# EAGLE design line tracer (EAGLE 9.5.0)
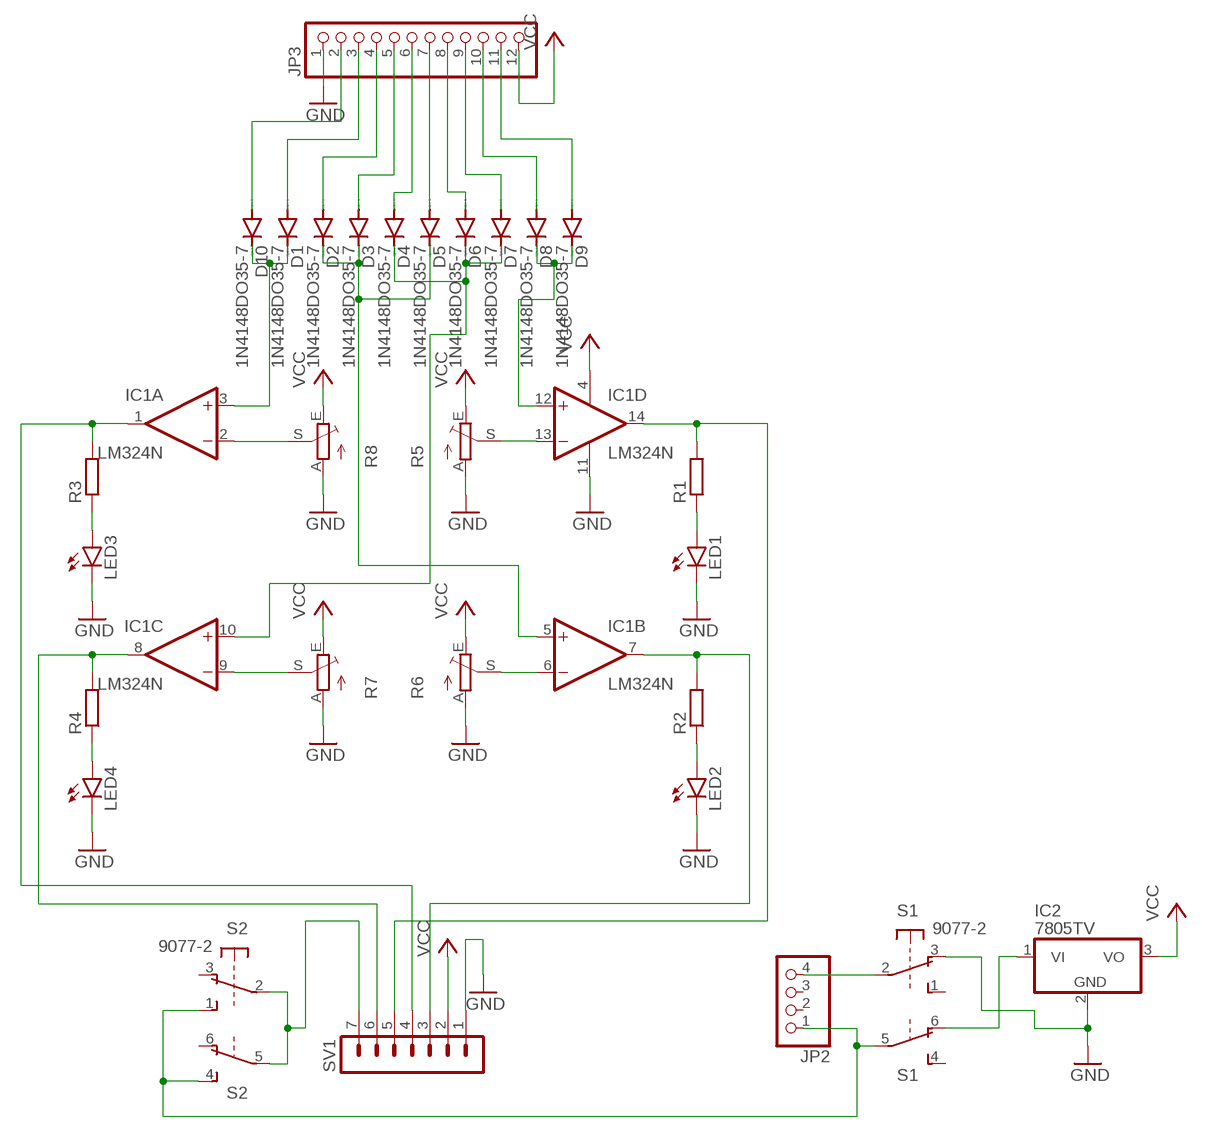
[diagram p0: schematic, sheet 1]

## Parts
D1  1N4148DO35-7  [DO35-7]
D2  1N4148DO35-7  [DO35-7]
D3  1N4148DO35-7  [DO35-7]
D4  1N4148DO35-7  [DO35-7]
D5  1N4148DO35-7  [DO35-7]
D6  1N4148DO35-7  [DO35-7]
D7  1N4148DO35-7  [DO35-7]
D8  1N4148DO35-7  [DO35-7]
D9  1N4148DO35-7  [DO35-7]
D10  1N4148DO35-7  [DO35-7]
IC1  LM324N  [DIL14]
IC2  7805TV  [TO220V]
JP2  PINHD-1X4  [1X04]
JP3  PINHD-1X12  [1X12]
LED1  LED3MM  [LED3MM]
LED2  LED3MM  [LED3MM]
LED3  LED3MM  [LED3MM]
LED4  LED3MM  [LED3MM]
R1  R-EU_0207/7  [0207/7]
R2  R-EU_0207/7  [0207/7]
R3  R-EU_0207/7  [0207/7]
R4  R-EU_0207/7  [0207/7]
R5  TRIM_EU-CA6V  [CA6V]
R6  TRIM_EU-CA6V  [CA6V]
R7  TRIM_EU-CA6V  [CA6V]
R8  TRIM_EU-CA6V  [CA6V]
S1  9077-2  [9077-2]
S2  9077-2  [9077-2]
SV1  MA07-1  [MA07-1]

## Nets
GND: IC1.11(P:V-) IC2.2(GND) JP3.1 LED1.K(C) LED2.K(C) LED3.K(C) LED4.K(C) R5.A R6.A R7.A R8.A S1.3(1:O) SV1.1
N$1: IC1.13(D:-IN) R5.S
N$2: IC1.2(A:-IN) R8.S
N$3: IC1.9(C:-IN) R7.S
N$4: IC1.6(B:-IN) R6.S
N$5: IC1.7(B:OUT) R2.2 SV1.3
N$6: LED2.A R2.1
N$7: LED1.A R1.1
N$8: IC1.14(D:OUT) R1.2 SV1.5
N$10: IC1.8(C:OUT) R4.2 SV1.6
N$11: LED3.A R3.1
N$12: LED4.A R4.1
N$13: JP2.4 S1.2(1:P)
N$14: JP2.1 S1.5(2:P) S2.1(1:S) S2.4(2:S)
N$15: IC2.1(VI) S1.6(2:O)
N$16: D10.A JP3.2
N$17: D1.C D10.C IC1.3(A:+IN)
N$18: D8.C D9.C IC1.12(D:+IN)
N$19: D2.C D3.C D5.C IC1.5(B:+IN)
N$20: S2.2(1:P) S2.5(2:P) SV1.7
N$21: D1.A JP3.3
N$22: D2.A JP3.4
N$23: D3.A JP3.5
N$24: D4.A JP3.6
N$25: IC1.1(A:OUT) R3.2 SV1.4
N$26: D5.A JP3.7
N$27: D6.A JP3.8
N$28: D7.A JP3.9
N$29: D8.A JP3.10
N$30: D9.A JP3.11
N$33: D4.C D6.C D7.C IC1.10(C:+IN)
VCC: IC1.4(P:V+) IC2.3(VO) JP3.12 R5.E R6.E R7.E R8.E SV1.2
Unconnected: JP2.2 JP2.3 S1.1(1:S) S1.4(2:S) S2.3(1:O) S2.6(2:O)

## Library data of the parts
D1-D10 = diode:1N4148: DIODE high speed (Philips)
IC1 = linear:LM324: OP AMP
IC2 = linear:78*: Positive VOLTAGE REGULATOR Source: http://cache.national.com/ds/LM/LM78L05.pdf http://www.fairchildsemi.com/ds/LM/LM7805.pdf
JP2 = pinhead:PINHD-1X4: PIN HEADER
JP3 = pinhead:PINHD-1X12: PIN HEADER
LED1-LED4 = led:LED: LED OSRAM: - CHIPLED LG R971, LG N971, LY N971, LG Q971, LY Q971, LO R971, LY R971 LH N974, LH R974 LS Q976, LO Q976, LY Q976 LO Q996 - Hyper CHIPLED LW Q18S LB Q993, LB Q99A, LB R99A - SideLED LS A670, LO A670, LY A670, LG A670, LP A670 LB A673, LV A673, LT A673, LW A673 LH A674 LY A675 LS A676, LA A676, LO A676, LY A676, LW A676 LS A679, LY A679, LG A679 - Hyper Micro SIDELED® LS Y876, LA Y876, LO Y876, LY Y876 LT Y87S - SmartLED LW L88C, LW L88S LB L89C, LB L89S, LG L890 LS L89K, LO L89K, LY L89K LS L896, LA L896, LO L896, LY L896 - TOPLED LS T670, LO T670, LY T670, LG T670, LP T670 LSG T670, LSP T670, LSY T670, LOP T670, LYG T670 LG T671, LOG T671, LSG T671 LB T673, LV T673, LT T673, LW T673 LH T674 LS T676, LA T676, LO T676, LY T676, LB T676, LH T676, LSB T676, LW T676 LB T67C, LV T67C, LT T67C, LS T67K, LO T67K, LY T67K, LW E67C LS E67B, LA E67B, LO E67B, LY E67B, LB E67C, LV E67C, LT E67C LW T67C LS T679, LY T679, LG T679 LS T770, LO T770, LY T770, LG T770, LP T770 LB T773, LV T773, LT T773, LW T773 LH T774 LS E675, LA E675, LY E675, LS T675 LS T776, LA T776, LO T776, LY T776, LB T776 LHGB T686 LT T68C, LB T68C - Hyper Mini TOPLED® LB M676 - Mini TOPLED Santana® LG M470 LS M47K, LO M47K, LY M47K Source: http://www.osram.convergy.de LUXEON: - LUMILED® LXK2-PW12-R00, LXK2-PW12-S00, LXK2-PW14-U00, LXK2-PW14-V00 LXK2-PM12-R00, LXK2-PM12-S00, LXK2-PM14-U00 LXK2-PE12-Q00, LXK2-PE12-R00, LXK2-PE12-S00, LXK2-PE14-T00, LXK2-PE14-U00 LXK2-PB12-K00, LXK2-PB12-L00, LXK2-PB12-M00, LXK2-PB14-N00, LXK2-PB14-P00, LXK2-PB14-Q00 LXK2-PR12-L00, LXK2-PR12-M00, LXK2-PR14-Q00, LXK2-PR14-R00 LXK2-PD12-Q00, LXK2-PD12-R00, LXK2-PD12-S00 LXK2-PH12-R00, LXK2-PH12-S00 LXK2-PL12-P00, LXK2-PL12-Q00, LXK2-PL12-R00 Source: www.luxeon.com KINGBRIGHT: KA-3528ASYC Source: www.kingbright.com
R1-R4 = rcl:R-EU_: RESISTOR, European symbol; SPICEPREFIX: R
R5-R8 = pot:TRIM_EU-: POTENTIOMETER
S1 S2 = switch-misc:9077-2: MARQUARDT SWITCH 9077.0200 Distributor: Buerklin <https://www.buerklin.com/default.asp?event=ShowArtikel%2812G2822%29&l=d&jump=ArtNr_12G2822>
SV1 = con-lstb:MA07-1: PIN HEADER; OC_FARNELL: unknown; OC_NEWARK: unknown

## Board
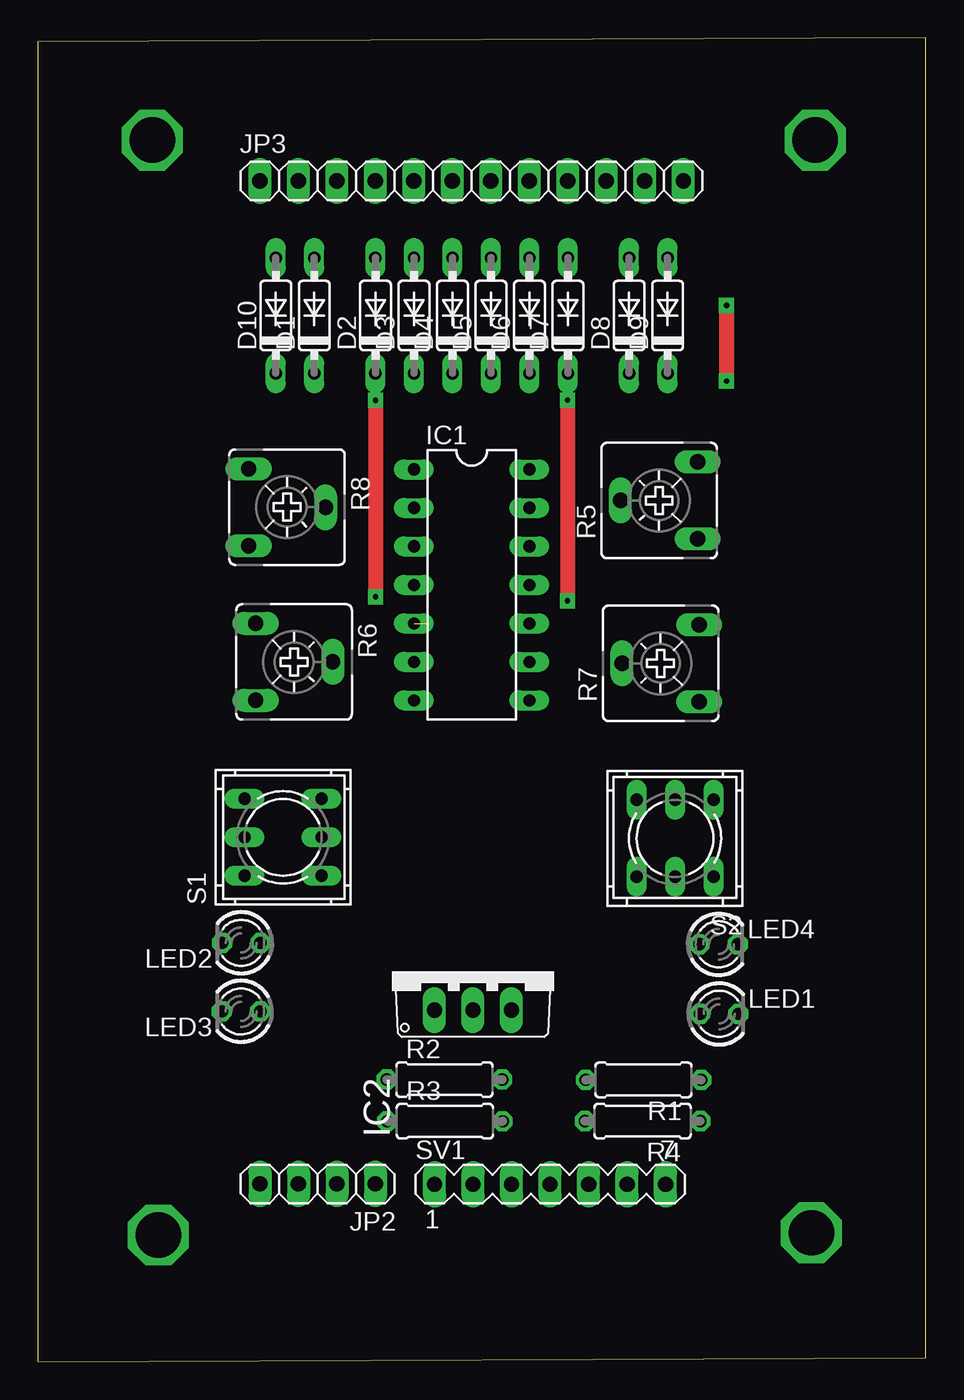
[diagram p1: board, top side]
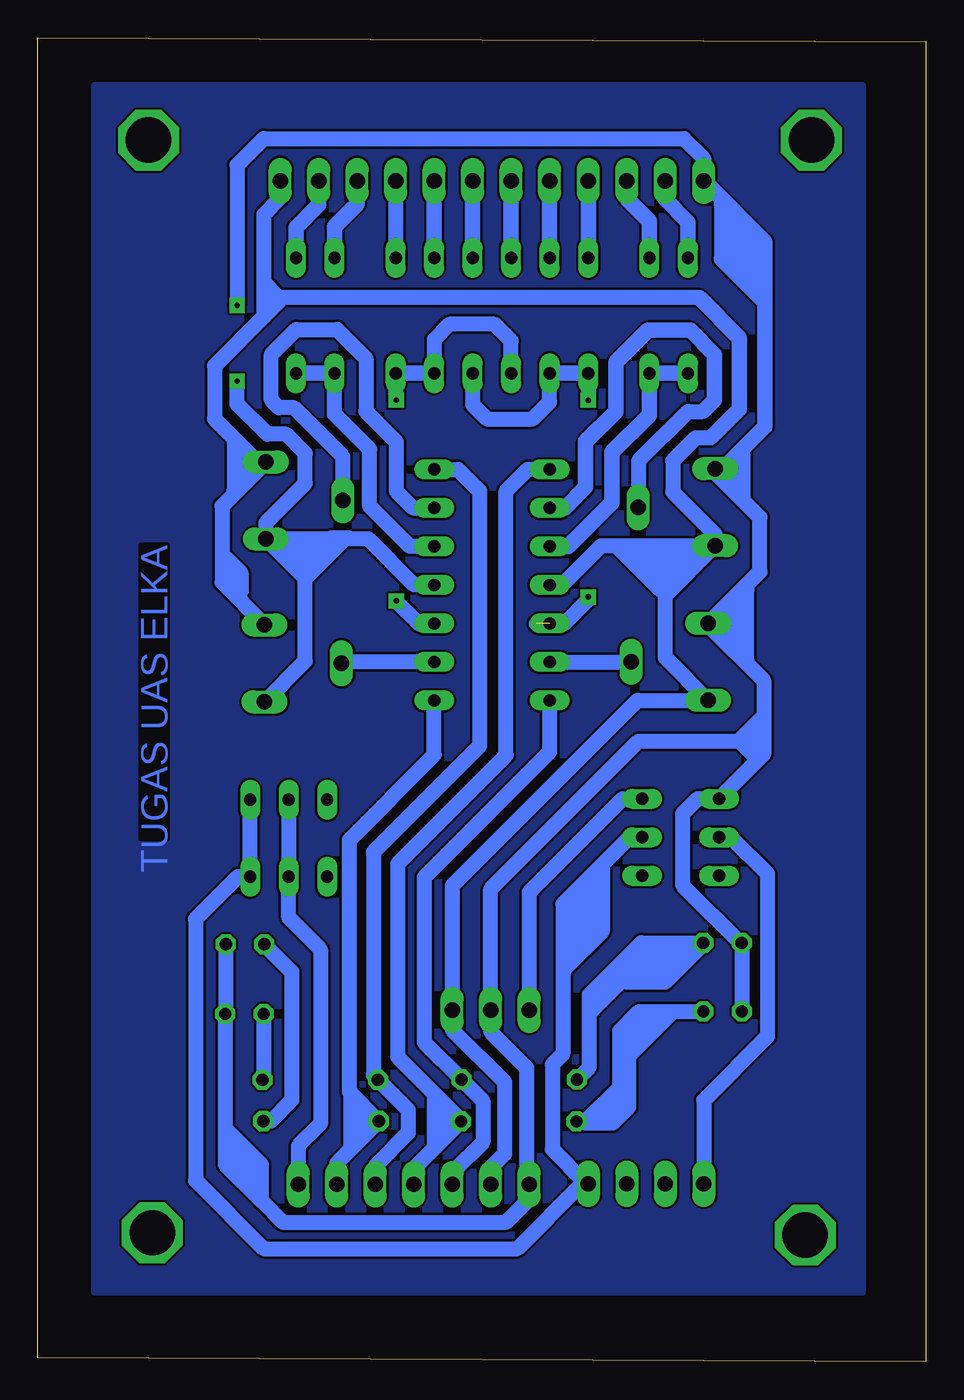
[diagram p2: board, bottom side, seen from below]

Size 58.6 x 87.35 mm. Coordinates in mm from the lower left corner, seen from the top.
Outline: 0,0 58.6,0.25 58.6,87.35 0,87.1 0,0
Copper layers (1*16): Top 0.035mm / dielectric 1.5mm / Bottom 0.035mm
Design rules "default": minimum track width 6mil, minimum drill 0.35mm, track to track 6mil, track to pad 6mil, pad to pad 6mil, via to via 6mil, smd to smd 6mil, copper to edge 40mil, drill to drill 6mil, minimum pad ring 10mil, minimum via ring 8mil, stop-mask expansion 4mil, vias tented up to drill 0mil, thermal gap 10mil

### Footprints (pad centres in the part's own frame; a part is rotated, then mirrored left to right if it is on the bottom)
DO35-7 = drill 0.813 long: A 3.81,0; C -3.81,0
DIL14 = drill 0.813 long: 1 -7.62,-3.81; 2 -5.08,-3.81; 3 -2.54,-3.81; 4 0,-3.81; 5 2.54,-3.81; 6 5.08,-3.81; 7 7.62,-3.81; 8 7.62,3.81; 9 5.08,3.81; 10 2.54,3.81; 11 0,3.81; 12 -2.54,3.81; 13 -5.08,3.81; 14 -7.62,3.81
TO220V = drill 1.016 long: 1 -2.54,-2.54; 2 0,-2.54; 3 2.54,-2.54
1X04 = drill 1.016 long: 1 -3.81,0; 2 -1.27,0; 3 1.27,0; 4 3.81,0
1X12 = drill 1.016 long: 1 -13.97,0; 2 -11.43,0; 3 -8.89,0; 4 -6.35,0; 5 -3.81,0; 6 -1.27,0; 7 1.27,0; 8 3.81,0; 9 6.35,0; 10 8.89,0; 11 11.43,0; 12 13.97,0
LED3MM = drill 0.813 octagon: A -1.27,0; K 1.27,0
0207/7 = drill 0.813 octagon: 1 -3.81,0; 2 3.81,0
CA6V = drill 1.016 long: A -2.54,-2.54; E 2.54,-2.54; S 0,2.54
9077-2 = drill 0.813 long: 1 -2.54,2.54; 2 0,2.54; 3 2.54,2.54; 4 -2.54,-2.54; 5 0,-2.54; 6 2.54,-2.54
MA07-1 = drill 1.016 long: 1 -7.62,0; 2 -5.08,0; 3 -2.54,0; 4 0,0; 5 2.54,0; 6 5.08,0; 7 7.62,0

### Placement (x,y rotation side)
D1  18.24,69.03 90 top
D2  22.28,69.03 90 top
D3  24.82,69.03 90 top
D4  27.36,69.03 90 top
D5  29.9,69.03 90 top
D6  32.44,69.03 90 top
D7  34.98,69.03 90 top
D8  39.02,69.03 90 top
D9  41.56,69.03 90 top
D10  15.7,69.03 90 top
IC1  28.63,51.25 270 top
IC2  28.72,25.74 0 top
JP2  18.47,11.73 180 top
JP3  28.63,77.92 0 top
LED1  44.97,22.95 0 top
LED2  13.42,27.63 180 top
LED3  13.41,23.11 180 top
LED4  44.93,27.54 0 top
R1  39.97,18.59 180 top
R2  26.83,18.61 0 top
R3  26.86,15.86 0 top
R4  39.91,15.87 180 top
R5  41,56.82 90 top
R6  16.91,46.17 270 top
R7  41.1,46.08 90 top
R8  16.45,56.39 270 top
S1  16.18,34.6 90 top
S2  42.05,34.53 180 top
SV1  33.8,11.7 0 top

### Tracks (layer width: path | path; a pad name or v marks a point on that pad's centre or on a via)
GND  (via drill 0.35 pad 1)
  Top 1: v45.45,69.7 v45.45,64.7
  Bottom 1: 10.62,61.7 13.39,58.93 R8.A 13.91,58.66 12.05,56.8 | IC1.11 33.76,51.25 36.79,54.28 R5.A | 12.05,56.8 10.95,55.7 10.95,52.13 R6.A 14.37,48.62 10.7,44.95 10.7,40.95 | R7.A 40.95,46.23 40.95,51.69 R5.A | 10.7,40.95 10.7,40.08 S1.3 15.06,37.14 16.05,36.15 16.05,31.43 12.25,27.63 LED2.K LED3.K | 12.3,40.95 18.95,40.95 28.72,31.18 IC2.2 | 12.3,40.95 10.7,40.95 | LED4.K 46.2,22.99 LED1.K 46.24,12.99 43.85,10.6 | IC2.2 28.7,23.18 | 43.85,10.6 42.45,9.2 27.7,9.2 26.18,10.72 SV1.1 26.35,11.87 26.35,19.4 28.72,21.77 IC2.2 | R5.A 43.54,55.36 40.95,57.95 40.95,59.95 42.2,61.2 43.45,61.2 45.45,63.2 v45.45,64.7 | v45.45,69.7 45.45,78.95 43.7,80.7 15.95,80.7 14.66,79.41 JP3.1 | 43.85,10.6 43.85,13 46.1,15.25 | 12.05,56.8 12.05,59.8 12.1,59.85 12.7,59.25 12.7,58.2 | 10.9,42.4 12.3,41 12.3,40.95 | 12.3,40.95 11.15,39.8
  Bottom 1.016: JP3.1 10.62,73.88 10.62,61.7
N$1
  Bottom 1: IC1.13 33.83,56.33 34.95,57.45 34.95,60.7 36.95,62.7 36.95,66.2 38.85,68.1 41.55,68.1 43.2,66.45 43.2,63.45 42.7,62.95 41.7,62.95 38.46,59.71 R5.S
N$2
  Bottom 1: R8.S 18.95,56.42 18.95,59.45 15.7,62.7 14.7,62.7 13.95,63.45
  Bottom 1.016: 13.95,63.45 13.95,66.45 15.55,68.05 18.35,68.05 20.45,65.95 20.45,62.7 22.45,60.7 22.45,57.7 23.82,56.33 IC1.2
N$3
  Bottom 1: R7.S 38.47,46.17 IC1.9
N$4
  Bottom 1: IC1.6 R6.S
N$5
  Bottom 1: IC1.7 24.82,40.24 33.11,31.95 33.11,21.08 R2.2 29.23,17.2 29.23,14.48 31.17,12.54 31.17,11.79 SV1.3
N$6
  Bottom 1: R2.1 22.2,19.43 22.2,24.2 18.77,27.63 LED2.A
N$7
  Bottom 1: LED1.A 43.7,18.59 R1.1
N$8
  Bottom 1: IC1.14 30.87,58.87 29.45,57.45 29.45,40.64 36.46,33.63 36.46,18.89 R1.2 34.17,16.6 34.17,15.08 36.25,13 36.25,11.79 SV1.5
N$9
  Bottom 1: 22.45,15.75 20.65,15.75 19.6,16.8 19.6,21 19.65,21.05 19.8,20.9 19.8,17.55 21.05,16.3
N$10
  Bottom 1: IC1.8 32.44,40.04 38.04,34.44 38.04,17.81 R4.2 38.88,13.09 SV1.6
N$11
  Bottom 1: R3.1 22.45,15.86 20.2,18.11 20.2,21.84 18.93,23.11 LED3.A
N$12
  Bottom 1: LED4.A 41.85,25.73 41.85,17.24 43.22,15.87 R4.1
N$13
  Bottom 1: S1.2 12.85,34.6 10.45,32.2 10.45,21.45 14.66,17.24 JP2.4
N$14
  Bottom 1: S1.5 19.55,34.6 23.95,30.2 23.95,20.3 24.65,19.6 24.65,14 22.53,11.88 22.68,11.73 | S2.4 S2.1 45.41,31.99 48.2,29.2 48.2,11.95 43.7,7.45 26.96,7.45 22.68,11.73 | 22.68,11.73 JP2.1
N$15
  Bottom 1: S1.6 20.01,37.14 26.18,30.97 IC2.1
N$16
  Bottom 1.016: JP3.2 17.2,76.7 15.7,75.2 D10.A
N$17
  Bottom 1.016: D10.C D1.C 18.24,62.47 20.7,60.01 20.7,56.7 23.61,53.79 IC1.3
N$18
  Bottom 1: IC1.12 34.04,53.79 36.7,56.45 36.7,60.2 39.02,62.52 D8.C
  Bottom 1.016: D8.C D9.C
N$19  (via drill 0.35 pad 1)  (1 unrouted)
  Top 1: v22.28,63.44 v22.28,50.46
  Bottom 1: 25.69,48.71 25.7,48.7 | D2.C v22.28,63.44 | IC1.5 23.82,48.71 22.32,50.21 22.32,50.42 v22.28,50.46 | D5.C 29.9,63.15 28.95,62.2 25.95,62.2 24.82,63.33 D3.C
  Bottom 1.016: D2.C D3.C
N$20
  Bottom 1: S2.5 S2.2 42.05,29.3 39.95,27.2 39.95,15.7 41.42,14.23 SV1.7
N$21
  Bottom 1.016: D1.A 18.24,75.24 19.74,76.74 JP3.3
N$22
  Bottom 1.016: JP3.4 D2.A
N$23
  Bottom 1.016: JP3.5 D3.A
N$24
  Bottom 1.016: JP3.6 D4.A
N$25
  Bottom 1: 31.7,14.95 31.7,16.95 | IC1.1 26.28,58.87 27.7,57.45 27.7,40 34.83,32.87 34.83,20.08 32.45,17.7 | 32.45,17.7 31.7,16.95 | 31.7,16.95 30.67,15.92 R3.2 33.71,12.82 33.71,11.79 SV1.4 | 32.45,17.7 32.45,14.2
N$26
  Bottom 1.016: JP3.7 D5.A
N$27
  Bottom 1.016: JP3.8 D6.A
N$28
  Bottom 1: JP3.9 D7.A
N$29
  Bottom 1.016: JP3.10 37.52,76.38 39.02,74.88 D8.A
N$30
  Bottom 1.016: JP3.11 40.06,76.34 41.56,74.84 D9.A
N$31
  Bottom 1: 37.2,14.95 37.2,16.95
N$32
  Bottom 1: 37.95,17.45 37.95,14.2
N$33  (via drill 0.35 pad 1)
  Top 1: v34.95,63.45 v34.95,50.2
  Bottom 1: D6.C 32.45,67.45 31.45,68.45 28.45,68.45 27.36,67.36 D4.C | D7.C 34.98,63.48 v34.95,63.45 | v34.95,50.2 33.45,48.7 IC1.10
  Bottom 1.016: D6.C D7.C
N$34
  Bottom 1: 38,17.95 38.05,17.9
N$35
  Bottom 1: 45.95,14.2 44.45,12.7 44.45,12 45.7,13.25 45.75,13.25
N$36  (via drill 3 pad 4)
  other vias: 7.55,80.6
N$37  (via drill 3 pad 4)
  other vias: 51.3,80.6
N$38  (via drill 3 pad 4)
  other vias: 7.95,8.35
N$39  (via drill 3 pad 4)
  other vias: 51.05,8.5
N$41
  Bottom 1: 17.85,22.8 20.15,20.5 20.15,20.45
N$42
  Bottom 1: 16.65,23.1 20.15,19.6 20.15,19.55
N$43
  Bottom 1: 17.65,27.55 22.05,23.15 22.05,23.1
N$44
  Bottom 1: 21.35,32.5 21.35,28.4 23.85,25.9
N$45
  Bottom 1: 21.7,31.65 23.15,30.2 23.15,27.15
N$46
  Bottom 1: 21.8,30.95 21.8,28.75 22.6,27.95
N$47
  Bottom 1: 22.5,30.5 22.5,28.85 22.4,28.75
N$48
  Bottom 1: 19.75,25.05 17.2,25.05 15.5,26.75 | 14.65,27.6 15.5,26.75 | 15.5,26.75 18.5,26.75 17.75,26 16.85,26 17.15,25.7 18.6,25.7
N$49
  Bottom 1: 46.2,53.05 45.2,52.05 45.2,50.75 45.9,51.45 45.9,51.95
N$50
  Bottom 1: 11.8,46.25 11.8,50.95 11.95,51.1 12.7,50.35 12.7,47.85 12.4,47.55
N$51
  Bottom 1: 13.5,76.4 13.5,72.75 12.8,72.05 | 10.8,70.05 12.8,72.05 | 12.8,72.05 12.8,75.6 11.45,74.25 11.45,73.3 | 11.45,71.35 11.45,73.3 | 11.45,73.3 12.15,74 | 12.35,74.2 12.15,74 | 12.15,74 12.15,71.9
N$52
  Bottom 1: 17.25,50.7 17.25,53.7 | 17.25,53.7 17.3,53.75 | 17.25,53.7 16.55,53 16.55,52.1 15.35,53.3 15.25,53.3
N$53
  Bottom 1: 15.55,53.3 16,53.3
N$54
  Bottom 1: 17.5,50.9 20.4,53.8 | 20.4,53.8 20.5,53.8 | 20.4,53.8 19.2,53.8 18.15,52.75 17.8,53.1 | 17.8,53.1 17.8,53.2 | 17.8,53.1 17.8,52.2 17.9,52.1
N$55
  Bottom 1: 40.9,51.75 38.3,54.35 | 38.3,54.35 38.1,54.35 | 38.3,54.35 39.2,54.35 40.9,52.65 41.1,52.65 42.05,53.6 | 42.15,53.7 42.05,53.6 | 42.05,53.6 40.65,53.6
PL
  pour Bottom: 4.2,84.2 54.85,84.2 54.85,4.6 4.2,4.6
VCC
  Bottom 1: 12.29,62.86 14.2,60.95 15.2,60.95 16.7,59.45 16.7,57.39 13.91,54.6 R8.E | IC1.4 24,51.25 21.41,53.85 R8.E | R7.E 46.45,51.43 46.45,56.46 R5.E 44.11,59.36 45.65,60.9 | R8.E 17.2,50.55 17.2,46.46 R6.E 19.02,43.63 31.26,31.39 IC2.3 31.26,21.91 27.8,18.45 27.8,13.7 28.72,12.78 SV1.2 | 45.65,60.9 46.95,62.2 46.95,65.7 43.7,68.95 | JP3.12 42.6,76.8 43.7,75.7 43.7,71.25 | 43.7,71.25 43.7,70.2 | 43.7,70.2 43.7,68.95 | 14.95,70.2 43.7,70.2 | 45.65,60.9 45.65,57.45 45.6,57.4 45.6,58.55 45,59.15 | 42.7,70.25 43.7,71.25 | 42.65,70.1 42.65,70 43.7,68.95
  Bottom 1.016: 14.95,70.2 12.29,67.54 12.29,62.86

### Text on the board
Bottom: TUGAS UAS ELKA